# Altium schematic sheet RF_125KHz.SchDoc
size D
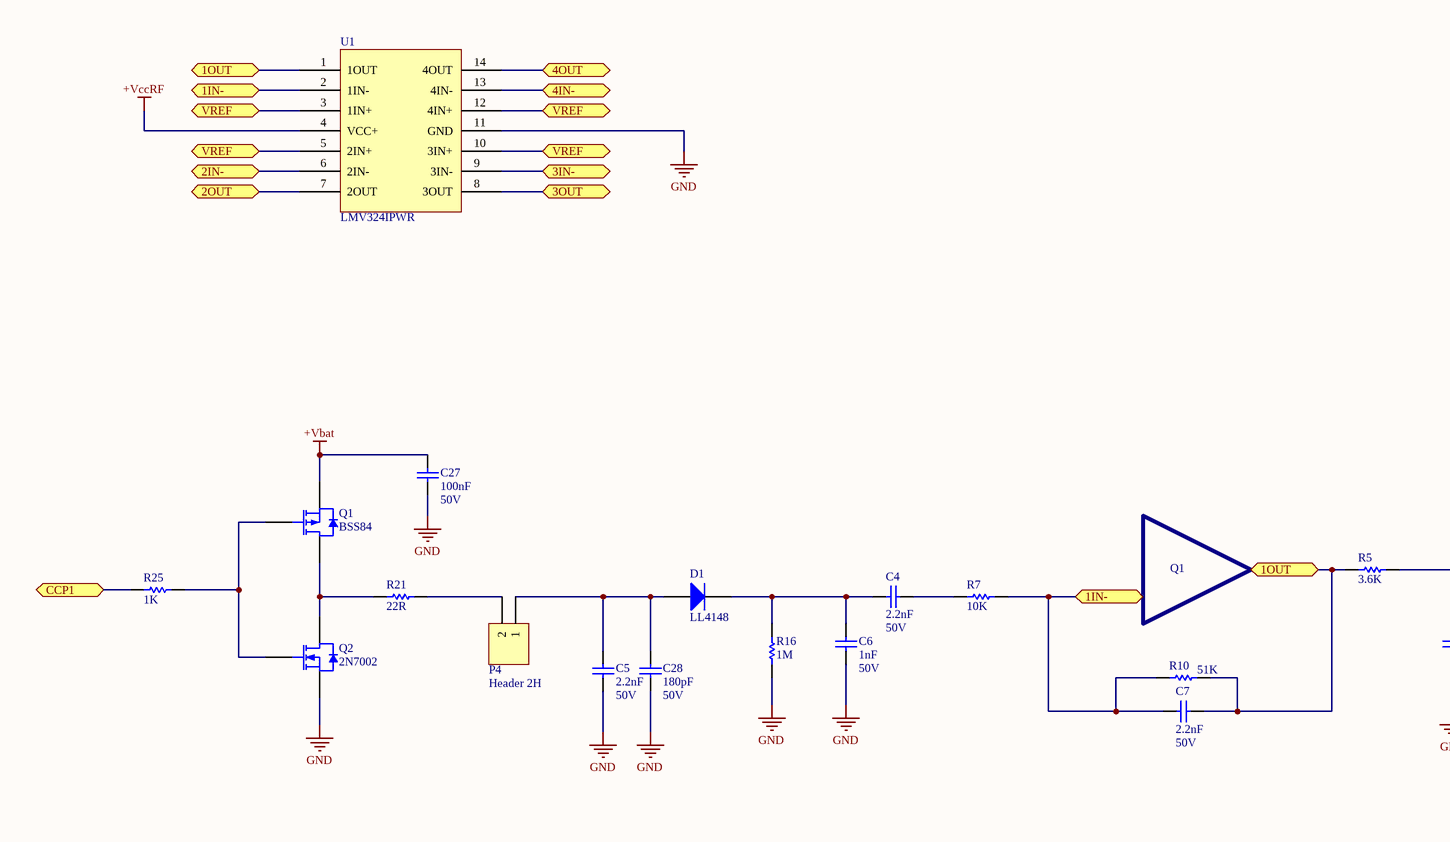
[diagram p0: RF_125KHz.SchDoc, left]
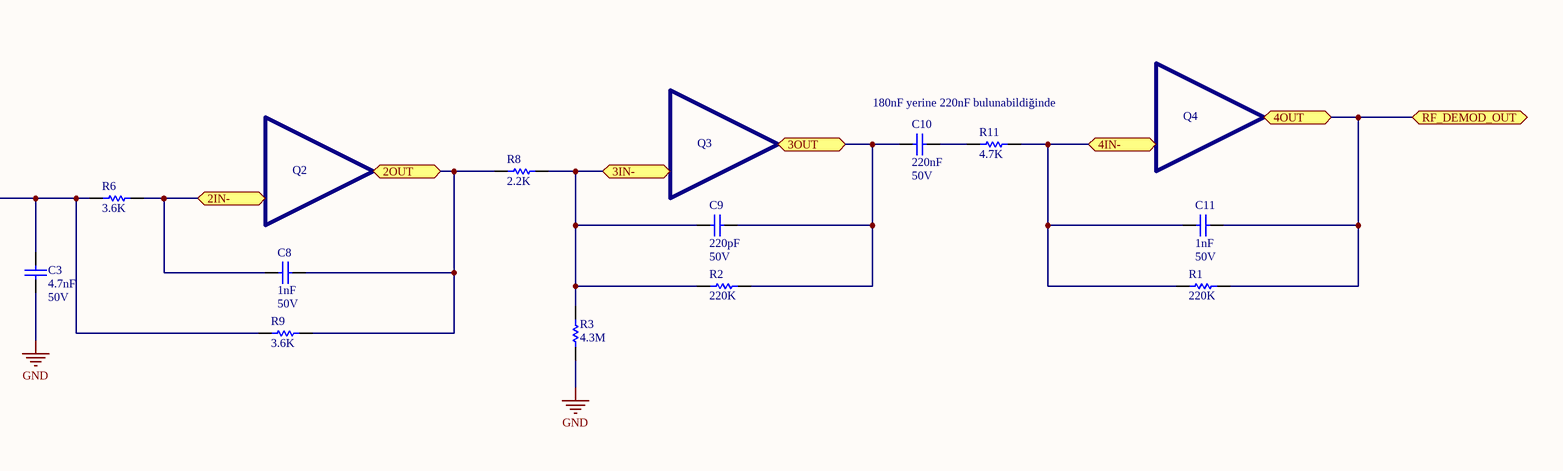
[diagram p1: RF_125KHz.SchDoc, right]

## Parts
C3  value 4.7nF  Voltage: 50V  [6-0805_N]  (hidden comment: Cap)
C4  value 2.2nF  Voltage: 50V  [6-0805_N]  (hidden comment: Cap)
C5  value 2.2nF  Voltage: 50V  [6-0805_N]  (hidden comment: Cap)
C6  value 1nF  Voltage: 50V  [6-0805_N]  (hidden comment: Cap)
C7  value 2.2nF  Voltage: 50V  [6-0805_N]  (hidden comment: Cap)
C8  value 1nF  Voltage: 50V  [6-0805_N]  (hidden comment: Cap)
C9  value 220pF  Voltage: 50V  [6-0805_N]  (hidden comment: Cap)
C10  value 220nF  Voltage: 50V  [6-0805_N]  (hidden comment: Cap)
C11  value 1nF  Voltage: 50V  [6-0805_N]  (hidden comment: Cap)
C27  value 100nF  Voltage: 50V  [3-0603_N]  (hidden comment: Cap)
C28  value 180pF  Voltage: 50V  [6-0805_N]  (hidden comment: Cap)
D1  LL4148  [DL-35 - S]
P4  Header 2H  [HDR1X2H-180 derece]
Q1  BSS84  [SOT23_N]
Q2  2N7002  [SOT23_N]
R1  value 220K  [6-0805_N]  (hidden comment: Res1)
R2  value 220K  [6-0805_N]  (hidden comment: Res1)
R3  value 4.3M  [6-0805_N]  (hidden comment: Res1)
R5  value 3.6K  [6-0805_N]  (hidden comment: Res1)
R6  value 3.6K  [6-0805_N]  (hidden comment: Res1)
R7  value 10K  [6-0805_N]  (hidden comment: Res1)
R8  value 2.2K  [6-0805_N]  (hidden comment: Res1)
R9  value 3.6K  [6-0805_N]  (hidden comment: Res1)
R10  value 51K  [6-0805_N]  (hidden comment: Res1)
R11  value 4.7K  [6-0805_N]  (hidden comment: Res1)
R16  value 1M  [6-0805_N]  (hidden comment: Res1)
R21  value 22R  [6-0805_N]  (hidden comment: Res1)
R25  value 1K  [3-0603_N]  (hidden comment: Res1)
U1  LMV324IPWR  [TSSOP-14N]

## Ports
1IN-, 1OUT, 2IN-, 2OUT, 3IN-, 3OUT, 4IN-, 4OUT (bidir), CCP1 (bidir), RF_DEMOD_OUT (bidir), VREF (bidir)

## Nets
+Vbat: C27.2 Q1.2(S)
+VccRF: U1.4(VCC+)
GND: C3.1 C5.2 C6.2 C27.1 C28.2 Q2.2(S) R3.2 R16.1 U1.11(GND)
1IN-: C7.1 R7.1 R10.2 U1.2(1IN-) ; port 1IN-
1OUT: C7.2 R5.2 R10.1 U1.1(1OUT) ; port 1OUT
2IN-: C8.1 R6.1 U1.6(2IN-) ; port 2IN-
2OUT: C8.2 R8.2 R9.1 U1.7(2OUT) ; port 2OUT
3IN-: C9.1 R2.2 R3.1 R8.1 U1.9(3IN-) ; port 3IN-
3OUT: C9.2 C10.1 R2.1 U1.8(3OUT) ; port 3OUT
4IN-: C11.1 R1.1 R11.2 U1.13(4IN-) ; port 4IN-
4OUT: C11.2 R1.2 U1.14(4OUT) ; port 4OUT, port RF_DEMOD_OUT
CCP1: R25.1 ; port CCP1
VREF: U1.3(1IN+) U1.5(2IN+) U1.10(3IN+) U1.12(4IN+) ; port VREF
NetC3_2: C3.2 R5.1 R6.2 R9.2
NetC4_1: C4.1 R7.2
NetC4_2: C4.2 C6.1 D1.2(K) R16.2
NetC5_1: C5.1 C28.1 D1.1(A) P4.1
NetC10_2: C10.2 R11.1
NetP4_2: P4.2 R21.2
NetQ1_1: Q1.1(G) Q2.1(G) R25.2
NetQ1_3: Q1.3(D) Q2.3(D) R21.1

## Notes on the sheet
- 180nF yerine 220nF bulunabildiğinde
- Q2
- Q3
- Q4
- Q1

## Library data of the parts
C3-C11 C27 C28 = Cap: Capacitor; Published: 8-Jun-2000; Revision: July-2002: Re-released for DXP Platform.; Publisher: Altium Limited
D1 = LL4148: 1 Amp General Purpose Rectifier; Published: 8-Jun-2000; LatestRevisionDate: 17-Jul-2002; LatestRevisionNote: Re-released for DXP Platform.; DatasheetDocument: 1998; PackageDocument: Aug-1999; Publisher: Altium Limited; Code_JEDEC: DO-204-AL; ComponentLink1Description: Manufacturer Link; ComponentLink1URL: http://www.fairchildsemi.com/; ComponentLink2Description: Datasheet; ComponentLink2URL: http://www.fairchildsemi.com/ds/1N%2F1N4001.pdf
P4 = Header 2H: Header, 2-Pin, Right Angle; LatestRevisionDate: 17-Jul-2002; LatestRevisionNote: Re-released for DXP Platform.; Publisher: Altium Limited
Q1 = BSS84: P-channel Enhancement Mode Vertical D-MOSFET; Published: 17-Sep-2003; LatestRevisionDate: 12-Dec-2006; LatestRevisionNote: IPC-7351 Footprint Added.; DatasheetVersion: 18-Jun-1997; PackageVersion: May-1999; PackageReference: SOT23; Publisher: Altium Limited; PackageDescription: 3-Pin SOT-23 Package 0.95 mm Pitch, 2.3 mm Lead Span; ComponentLink1Description: Manufacturer Link; ComponentLink1URL: http://www.semiconductors.philips.com/; ComponentLink2Description: Datasheet; ComponentLink2URL: http://www.semiconductors.philips.com/acrobat/datasheets/BSS84_3.pdf
Q2 = 2N7002: N-channel Enhancement Mode Field-effect Transistor; Published: 17-Sep-2003; LatestRevisionDate: 12-Dec-2006; LatestRevisionNote: IPC-7351 Footprint Added.; DatasheetVersion: 27-Jul-2000; PackageVersion: May-1999; PackageReference: SOT23; Publisher: Altium Limited; PackageDescription: 3-Pin SOT-23 Package 0.95 mm Pitch, 2.3 mm Lead Span; ComponentLink1Description: Manufacturer Link; ComponentLink1URL: http://www.semiconductors.philips.com/; ComponentLink2Description: Datasheet; ComponentLink2URL: http://www.semiconductors.philips.com/acrobat/datasheets/2N7002_4.pdf
R1-R3 R5-R11 R16 R21 R25 = Res1: Resistor; Published: 8-Jun-2000; LatestRevisionDate: 17-Jul-2002; LatestRevisionNote: Re-released for DXP Platform.; PackageReference: AXIAL-0.3; Publisher: Altium Limited
U1 = LMV324IPWR: IC OPAMP GP R-R 1MHZ 14TSSOP; Manufacturer: Texas Instruments; .Checked PCB: *; .Checked SCH: *; Category: Integrated Circuits (ICs); Digi-Key Part Number: 296-9570-2-ND; Manufacturer Part Number: LMV324IPWR; Package / Case: 14-TSSOP (0.173", 4.40mm Width); Family: Linear - Amplifiers - Instrumentation, OP Amps, Buffer Amps; Price 1k [$]: 0.14375; Standard Package: 2000